# Altium schematic sheet DC075B_DEVICE_PINOUT.SchDoc: DEVICE PINOUT
size 558 x 431 mm; DrawnBy: Praveen Aroul; DocumentNumber: 6; SheetNumber: 6; SheetTotal: 13; PageSetup: Record=PageOptions|CenterHorizontal=True|CenterVertical=True|PrintScale=1.00|XCorrection=1.00|YCorrection=1.00|PrintKind=0|BorderSize=5000000|LeftOffset=0|BottomOffset=0|Orientation=2|PaperLength=1000|PaperWidth=1000|Scale=100|PaperSource=15|PrintQuality=600|MediaType=1|DitherType=10|PaperKind=Letter|PrintScaleMode=1
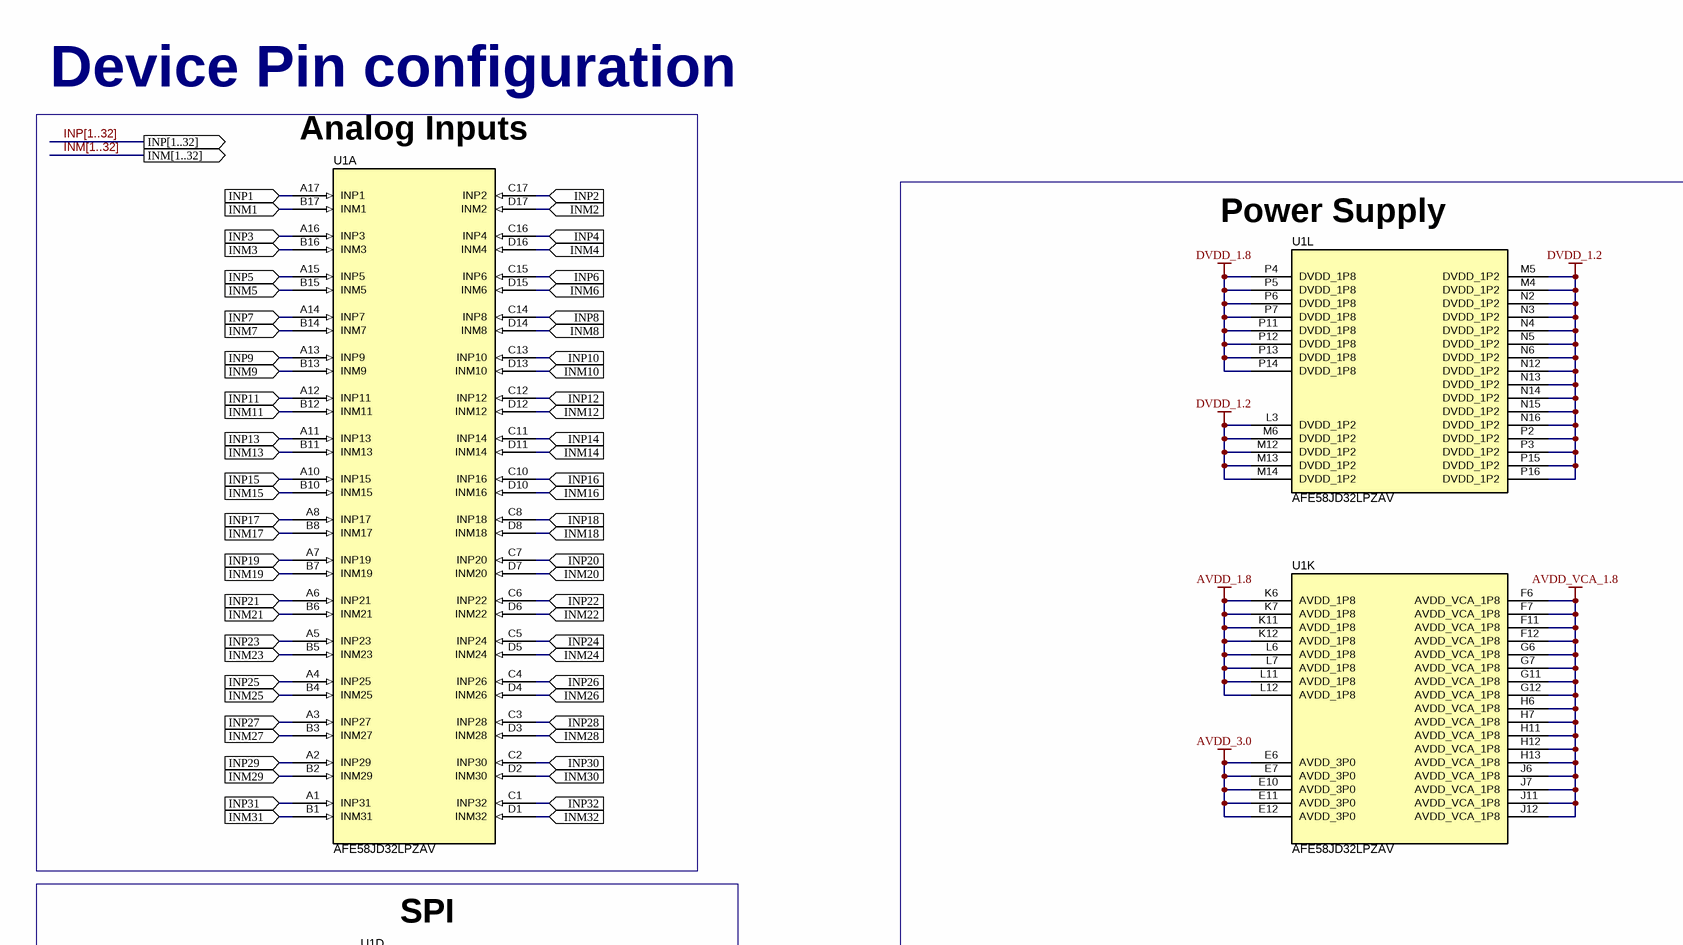
[diagram p0: DC075B_DEVICE_PINOUT.SchDoc, top left]
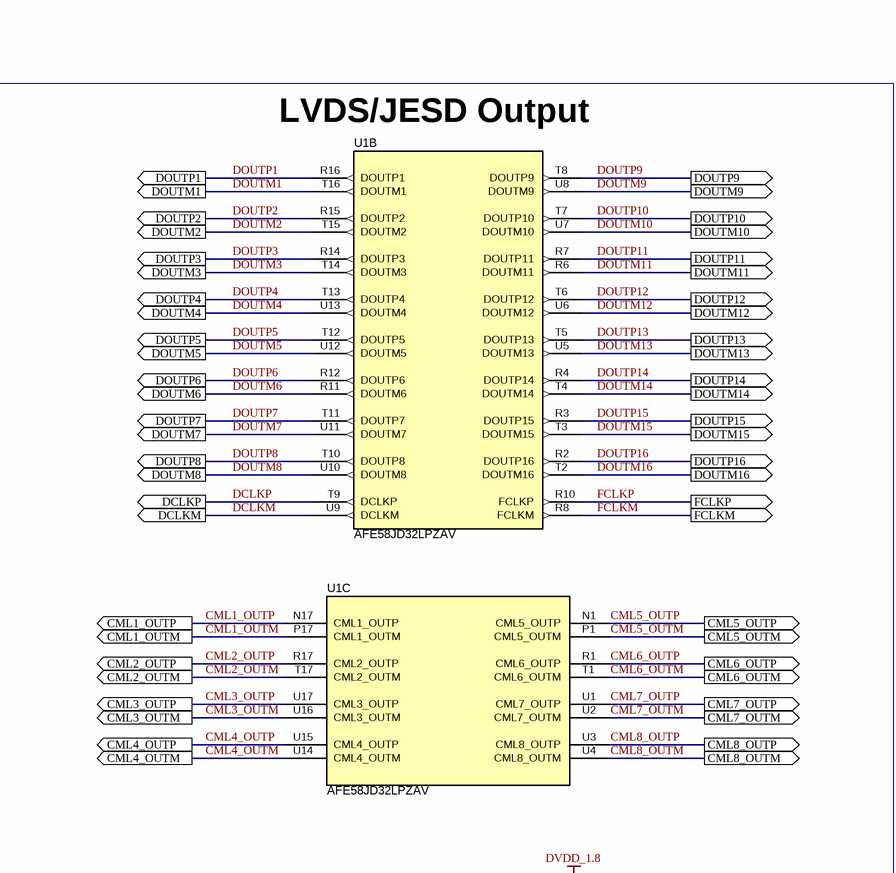
[diagram p1: DC075B_DEVICE_PINOUT.SchDoc, top right]
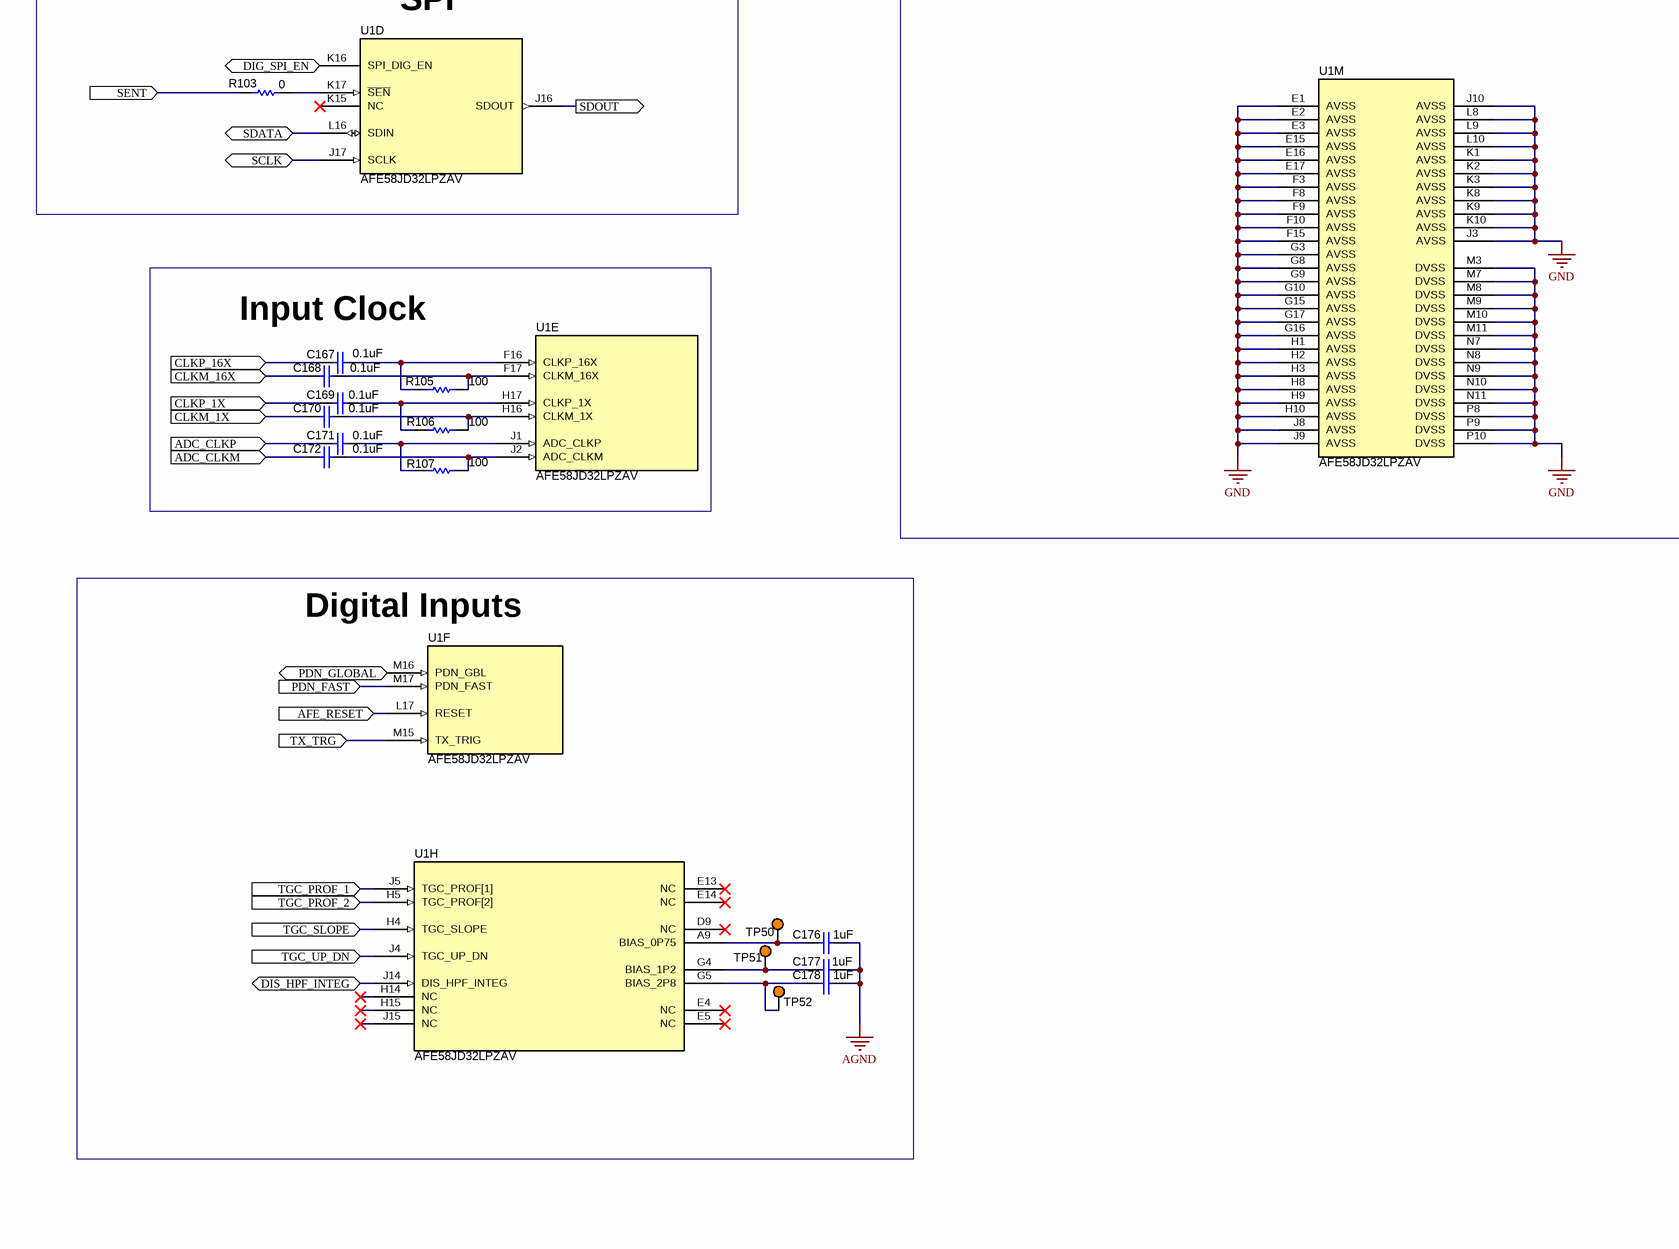
[diagram p2: DC075B_DEVICE_PINOUT.SchDoc, bottom left]
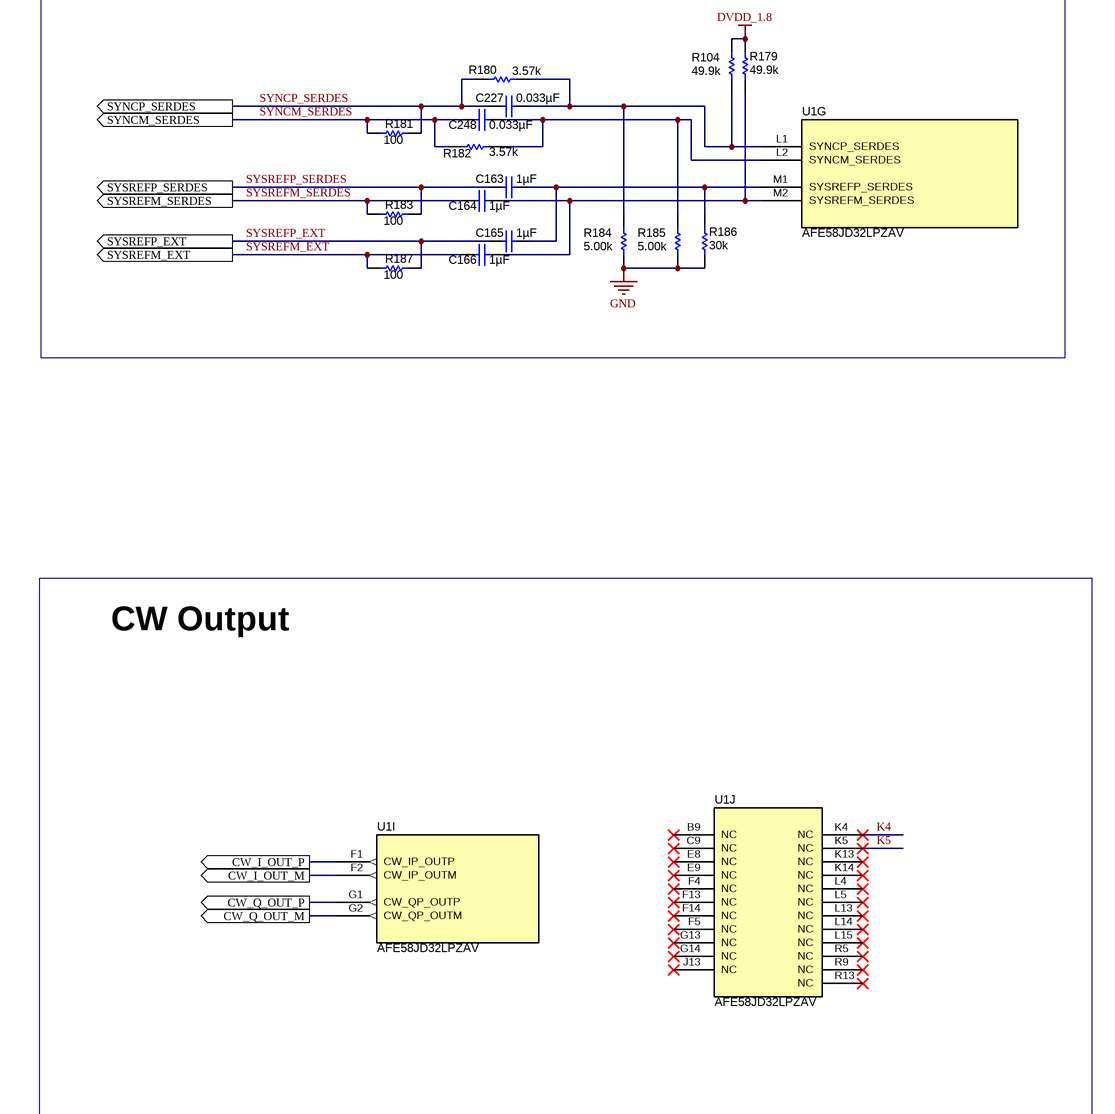
[diagram p3: DC075B_DEVICE_PINOUT.SchDoc, bottom right]

## Parts
C163  ValueDisplayed: 1µF  [0402]  (hidden comment: CL05A105JQ5NNNC)
C164  ValueDisplayed: 1µF  [0402]  (hidden comment: CL05A105JQ5NNNC)
C165  ValueDisplayed: 1µF  [0402]  (hidden comment: CL05A105JQ5NNNC)
C166  ValueDisplayed: 1µF  [0402]  (hidden comment: CL05A105JQ5NNNC)
C167  value 0.1uF  [0402]  (hidden comment: Capacitor)
C168  value 0.1uF  [0402]  (hidden comment: Capacitor)
C169  value 0.1uF  [0402]  (hidden comment: Capacitor)
C170  value 0.1uF  [0402]  (hidden comment: Capacitor)
C171  value 0.1uF  [0402]  (hidden comment: Capacitor)
C172  value 0.1uF  [0402]  (hidden comment: Capacitor)
C176  value 1uF  [0402]  (hidden comment: Capacitor)
C177  value 1uF  [0402]  (hidden comment: Capacitor)
C178  value 1uF  [0402]  (hidden comment: Capacitor)
C227  ValueDisplayed: 0.033µF  [0402]  (hidden comment: 0402YD333KAT2A)
C248  ValueDisplayed: 0.033µF  [0402]  (hidden comment: 0402YD333KAT2A)
R103  value 0  [0402]  (hidden comment: Resistor)
R104  ValueDisplayed: 49.9k  [0402]  (hidden comment: Resistor)
R105  ValueDisplayed: 100  [0402]  (hidden comment: Resistor)
R106  ValueDisplayed: 100  [0402]  (hidden comment: Resistor)
R107  ValueDisplayed: 100  [0402]  (hidden comment: Resistor)
R179  ValueDisplayed: 49.9k  [0402]  (hidden comment: Resistor)
R180  ValueDisplayed: 3.57k  [0402]  (hidden comment: Resistor)
R181  ValueDisplayed: 100  [0402]  (hidden comment: Resistor)
R182  ValueDisplayed: 3.57k  [0402]  (hidden comment: Resistor)
R183  ValueDisplayed: 100  [0402]  (hidden comment: Resistor)
R184  ValueDisplayed: 5.00k  [0402]  (hidden comment: Resistor)
R185  ValueDisplayed: 5.00k  [0402]  (hidden comment: Resistor)
R186  ValueDisplayed: 30k  [0402]  (hidden comment: Resistor)
R187  ValueDisplayed: 100  [0402]  (hidden comment: Resistor)
TP50  5003  [Keystone5003]  (value not drawn)
TP51  5003  [Keystone5003]  (value not drawn)
TP52  5003  [Keystone5003]  (value not drawn)
U1  AFE58JD32LPZAV  [ZAV0289A]  (parts A,B,C,D,E,F,G,H,I,J,K,L,M of 13)

## Blocks framed on the sheet
Device Pin configuration: U1
Power Supply: U1
LVDS/JESD Output: C163-C166 C227 C248 R104 R179-R187 U1
SPI: R103 U1
Input Clock: C167-C172 R105-R107 U1
Digital Inputs: C176-C178 TP50-TP52 U1
CW Output: U1

## Ports
ADC_CLKM (in), ADC_CLKP (in), AFE_RESET (in), CLKM_1X (in), CLKM_16X (in), CLKP_1X (in), CLKP_16X (in), CML1_OUTM (out), CML1_OUTP (out), CML2_OUTM (out), CML2_OUTP (out), CML3_OUTM (out), CML3_OUTP (out), CML4_OUTM (out), CML4_OUTP (out), CML5_OUTM (out), CML5_OUTP (out), CML6_OUTM (out), CML6_OUTP (out), CML7_OUTM (out), CML7_OUTP (out), CML8_OUTM (out), CML8_OUTP (out), CW_I_OUT_M (out), CW_I_OUT_P (out), CW_Q_OUT_M (out), CW_Q_OUT_P (out), DCLKM (out), DCLKP (out), DIG_SPI_EN (in), DIS_HPF_INTEG (bidir), DOUTM1 (out), DOUTM2 (out), DOUTM3 (out), DOUTM4 (out), DOUTM5 (out), DOUTM6 (out), DOUTM7 (out), DOUTM8 (out), DOUTM9 (out), DOUTM10 (out), DOUTM11 (out), DOUTM12 (out), DOUTM13 (out), DOUTM14 (out), DOUTM15 (out), DOUTM16 (out), DOUTP1 (out), DOUTP2 (out), DOUTP3 (out), DOUTP4 (out), DOUTP5 (out), DOUTP6 (out), DOUTP7 (out), DOUTP8 (out), DOUTP9 (out), DOUTP10 (out), DOUTP11 (out), DOUTP12 (out), DOUTP13 (out), DOUTP14 (out), DOUTP15 (out), DOUTP16 (out), FCLKM (out), FCLKP (out), INM1 (in), INM2 (in), INM3 (in), INM4 (in), INM5 (in), INM6 (in), INM7 (in), INM8 (in), INM9 (in), INM10 (in), INM11 (in), INM12 (in), INM13 (in), INM14 (in), INM15 (in), INM16 (in), INM17 (in), INM18 (in), INM19 (in), INM20 (in), INM21 (in), INM22 (in), INM23 (in), INM24 (in), INM25 (in), INM26 (in), INM27 (in), INM28 (in), INM29 (in), INM30 (in), INM31 (in), INM32 (in), INM[1..32] (out), INP1 (in), INP2 (in), INP3 (in), INP4 (in), INP5 (in), INP6 (in), INP7 (in), INP8 (in), INP9 (in), INP10 (in), INP11 (in), INP12 (in), INP13 (in), INP14 (in), INP15 (in), INP16 (in), INP17 (in), INP18 (in), INP19 (in), INP20 (in), INP21 (in), INP22 (in), INP23 (in), INP24 (in), INP25 (in), INP26 (in), INP27 (in), INP28 (in), INP29 (in), INP30 (in), INP31 (in), INP32 (in), INP[1..32] (out), PDN_FAST (in), PDN_GLOBAL (in), SCLK, SDATA, SDOUT (out), SENT (in), SYNCM_SERDES (out), SYNCP_SERDES (out), SYSREFM_EXT (out), SYSREFM_SERDES (out), SYSREFP_EXT (out), SYSREFP_SERDES (out), TGC_PROF_1 (in), TGC_PROF_2 (in), TGC_SLOPE (in), TGC_UP_DN (in), TX_TRG (in)

## Nets
AGND: C176.2 C177.2 C178.2
AVDD_1.8: U1.K6(AVDD_1P8) U1.K7(AVDD_1P8) U1.K11(AVDD_1P8) U1.K12(AVDD_1P8) U1.L6(AVDD_1P8) U1.L7(AVDD_1P8) U1.L11(AVDD_1P8) U1.L12(AVDD_1P8)
AVDD_3.0: U1.E6(AVDD_3P0) U1.E7(AVDD_3P0) U1.E10(AVDD_3P0) U1.E11(AVDD_3P0) U1.E12(AVDD_3P0)
AVDD_VCA_1.8: U1.F6(AVDD_VCA_1P8) U1.F7(AVDD_VCA_1P8) U1.F11(AVDD_VCA_1P8) U1.F12(AVDD_VCA_1P8) U1.G6(AVDD_VCA_1P8) U1.G7(AVDD_VCA_1P8) U1.G11(AVDD_VCA_1P8) U1.G12(AVDD_VCA_1P8) U1.H6(AVDD_VCA_1P8) U1.H7(AVDD_VCA_1P8) U1.H11(AVDD_VCA_1P8) U1.H12(AVDD_VCA_1P8) U1.H13(AVDD_VCA_1P8) U1.J6(AVDD_VCA_1P8) U1.J7(AVDD_VCA_1P8) U1.J11(AVDD_VCA_1P8) U1.J12(AVDD_VCA_1P8)
DVDD_1.2: U1.L3(DVDD_1P2) U1.M4(DVDD_1P2) U1.M5(DVDD_1P2) U1.M6(DVDD_1P2) U1.M12(DVDD_1P2) U1.M13(DVDD_1P2) U1.M14(DVDD_1P2) U1.N2(DVDD_1P2) U1.N3(DVDD_1P2) U1.N4(DVDD_1P2) U1.N5(DVDD_1P2) U1.N6(DVDD_1P2) U1.N12(DVDD_1P2) U1.N13(DVDD_1P2) U1.N14(DVDD_1P2) U1.N15(DVDD_1P2) U1.N16(DVDD_1P2) U1.P2(DVDD_1P2) U1.P3(DVDD_1P2) U1.P15(DVDD_1P2) U1.P16(DVDD_1P2)
DVDD_1.8: R104.2 R179.2 U1.P4(DVDD_1P8) U1.P5(DVDD_1P8) U1.P6(DVDD_1P8) U1.P7(DVDD_1P8) U1.P11(DVDD_1P8) U1.P12(DVDD_1P8) U1.P13(DVDD_1P8) U1.P14(DVDD_1P8)
GND: R184.1 R185.1 R186.1 U1.E1(AVSS) U1.E2(AVSS) U1.E3(AVSS) U1.E15(AVSS) U1.E16(AVSS) U1.E17(AVSS) U1.F3(AVSS) U1.F8(AVSS) U1.F9(AVSS) U1.F10(AVSS) U1.F15(AVSS) U1.G3(AVSS) U1.G8(AVSS) U1.G9(AVSS) U1.G10(AVSS) U1.G15(AVSS) U1.G16(AVSS) U1.G17(AVSS) U1.H1(AVSS) U1.H2(AVSS) U1.H3(AVSS) U1.H8(AVSS) U1.H9(AVSS) U1.H10(AVSS) U1.J3(AVSS) U1.J8(AVSS) U1.J9(AVSS) U1.J10(AVSS) U1.K1(AVSS) U1.K2(AVSS) U1.K3(AVSS) U1.K8(AVSS) U1.K9(AVSS) U1.K10(AVSS) U1.L8(AVSS) U1.L9(AVSS) U1.L10(AVSS) U1.M3(DVSS) U1.M7(DVSS) U1.M8(DVSS) U1.M9(DVSS) U1.M10(DVSS) U1.M11(DVSS) U1.N7(DVSS) U1.N8(DVSS) U1.N9(DVSS) U1.N10(DVSS) U1.N11(DVSS) U1.P8(DVSS) U1.P9(DVSS) U1.P10(DVSS)
ADC_CLKM: C172.2 ; port ADC_CLKM
ADC_CLKP: C171.2 ; port ADC_CLKP
AFE_RESET: U1.L17(RESET) ; port AFE_RESET
CLKM_1X: C170.2 ; port CLKM_1X
CLKM_16X: C168.2 ; port CLKM_16X
CLKP_1X: C169.2 ; port CLKP_1X
CLKP_16X: C167.2 ; port CLKP_16X
CML1_OUTM: U1.P17(CML1_OUTM) ; port CML1_OUTM
CML1_OUTP: U1.N17(CML1_OUTP) ; port CML1_OUTP
CML2_OUTM: U1.T17(CML2_OUTM) ; port CML2_OUTM
CML2_OUTP: U1.R17(CML2_OUTP) ; port CML2_OUTP
CML3_OUTM: U1.U16(CML3_OUTM) ; port CML3_OUTM
CML3_OUTP: U1.U17(CML3_OUTP) ; port CML3_OUTP
CML4_OUTM: U1.U14(CML4_OUTM) ; port CML4_OUTM
CML4_OUTP: U1.U15(CML4_OUTP) ; port CML4_OUTP
CML5_OUTM: U1.P1(CML5_OUTM) ; port CML5_OUTM
CML5_OUTP: U1.N1(CML5_OUTP) ; port CML5_OUTP
CML6_OUTM: U1.T1(CML6_OUTM) ; port CML6_OUTM
CML6_OUTP: U1.R1(CML6_OUTP) ; port CML6_OUTP
CML7_OUTM: U1.U2(CML7_OUTM) ; port CML7_OUTM
CML7_OUTP: U1.U1(CML7_OUTP) ; port CML7_OUTP
CML8_OUTM: U1.U4(CML8_OUTM) ; port CML8_OUTM
CML8_OUTP: U1.U3(CML8_OUTP) ; port CML8_OUTP
CW_I_OUT_M: U1.F2(CW_IP_OUTM) ; port CW_I_OUT_M
CW_I_OUT_P: U1.F1(CW_IP_OUTP) ; port CW_I_OUT_P
CW_Q_OUT_M: U1.G2(CW_QP_OUTM) ; port CW_Q_OUT_M
CW_Q_OUT_P: U1.G1(CW_QP_OUTP) ; port CW_Q_OUT_P
DCLKM: U1.U9(DCLKM) ; port DCLKM
DCLKP: U1.T9(DCLKP) ; port DCLKP
DIG_SPI_EN: U1.K16(SPI_DIG_EN) ; port DIG_SPI_EN
DIS_HPF_INTEG: U1.J14(DIS_HPF_INTEG) ; port DIS_HPF_INTEG
DOUTM1: U1.T16(DOUTM1) ; port DOUTM1
DOUTM2: U1.T15(DOUTM2) ; port DOUTM2
DOUTM3: U1.T14(DOUTM3) ; port DOUTM3
DOUTM4: U1.U13(DOUTM4) ; port DOUTM4
DOUTM5: U1.U12(DOUTM5) ; port DOUTM5
DOUTM6: U1.R11(DOUTM6) ; port DOUTM6
DOUTM7: U1.U11(DOUTM7) ; port DOUTM7
DOUTM8: U1.U10(DOUTM8) ; port DOUTM8
DOUTM9: U1.U8(DOUTM9) ; port DOUTM9
DOUTM10: U1.U7(DOUTM10) ; port DOUTM10
DOUTM11: U1.R6(DOUTM11) ; port DOUTM11
DOUTM12: U1.U6(DOUTM12) ; port DOUTM12
DOUTM13: U1.U5(DOUTM13) ; port DOUTM13
DOUTM14: U1.T4(DOUTM14) ; port DOUTM14
DOUTM15: U1.T3(DOUTM15) ; port DOUTM15
DOUTM16: U1.T2(DOUTM16) ; port DOUTM16
DOUTP1: U1.R16(DOUTP1) ; port DOUTP1
DOUTP2: U1.R15(DOUTP2) ; port DOUTP2
DOUTP3: U1.R14(DOUTP3) ; port DOUTP3
DOUTP4: U1.T13(DOUTP4) ; port DOUTP4
DOUTP5: U1.T12(DOUTP5) ; port DOUTP5
DOUTP6: U1.R12(DOUTP6) ; port DOUTP6
DOUTP7: U1.T11(DOUTP7) ; port DOUTP7
DOUTP8: U1.T10(DOUTP8) ; port DOUTP8
DOUTP9: U1.T8(DOUTP9) ; port DOUTP9
DOUTP10: U1.T7(DOUTP10) ; port DOUTP10
DOUTP11: U1.R7(DOUTP11) ; port DOUTP11
DOUTP12: U1.T6(DOUTP12) ; port DOUTP12
DOUTP13: U1.T5(DOUTP13) ; port DOUTP13
DOUTP14: U1.R4(DOUTP14) ; port DOUTP14
DOUTP15: U1.R3(DOUTP15) ; port DOUTP15
DOUTP16: U1.R2(DOUTP16) ; port DOUTP16
FCLKM: U1.R8(FCLKM) ; port FCLKM
FCLKP: U1.R10(FCLKP) ; port FCLKP
INM1: U1.B17(INM1) ; port INM1
INM2: U1.D17(INM2) ; port INM2
INM3: U1.B16(INM3) ; port INM3
INM4: U1.D16(INM4) ; port INM4
INM5: U1.B15(INM5) ; port INM5
INM6: U1.D15(INM6) ; port INM6
INM7: U1.B14(INM7) ; port INM7
INM8: U1.D14(INM8) ; port INM8
INM9: U1.B13(INM9) ; port INM9
INM10: U1.D13(INM10) ; port INM10
INM11: U1.B12(INM11) ; port INM11
INM12: U1.D12(INM12) ; port INM12
INM13: U1.B11(INM13) ; port INM13
INM14: U1.D11(INM14) ; port INM14
INM15: U1.B10(INM15) ; port INM15
INM16: U1.D10(INM16) ; port INM16
INM17: U1.B8(INM17) ; port INM17
INM18: U1.D8(INM18) ; port INM18
INM19: U1.B7(INM19) ; port INM19
INM20: U1.D7(INM20) ; port INM20
INM21: U1.B6(INM21) ; port INM21
INM22: U1.D6(INM22) ; port INM22
INM23: U1.B5(INM23) ; port INM23
INM24: U1.D5(INM24) ; port INM24
INM25: U1.B4(INM25) ; port INM25
INM26: U1.D4(INM26) ; port INM26
INM27: U1.B3(INM27) ; port INM27
INM28: U1.D3(INM28) ; port INM28
INM29: U1.B2(INM29) ; port INM29
INM30: U1.D2(INM30) ; port INM30
INM31: U1.B1(INM31) ; port INM31
INM32: U1.D1(INM32) ; port INM32
INP1: U1.A17(INP1) ; port INP1
INP2: U1.C17(INP2) ; port INP2
INP3: U1.A16(INP3) ; port INP3
INP4: U1.C16(INP4) ; port INP4
INP5: U1.A15(INP5) ; port INP5
INP6: U1.C15(INP6) ; port INP6
INP7: U1.A14(INP7) ; port INP7
INP8: U1.C14(INP8) ; port INP8
INP9: U1.A13(INP9) ; port INP9
INP10: U1.C13(INP10) ; port INP10
INP11: U1.A12(INP11) ; port INP11
INP12: U1.C12(INP12) ; port INP12
INP13: U1.A11(INP13) ; port INP13
INP14: U1.C11(INP14) ; port INP14
INP15: U1.A10(INP15) ; port INP15
INP16: U1.C10(INP16) ; port INP16
INP17: U1.A8(INP17) ; port INP17
INP18: U1.C8(INP18) ; port INP18
INP19: U1.A7(INP19) ; port INP19
INP20: U1.C7(INP20) ; port INP20
INP21: U1.A6(INP21) ; port INP21
INP22: U1.C6(INP22) ; port INP22
INP23: U1.A5(INP23) ; port INP23
INP24: U1.C5(INP24) ; port INP24
INP25: U1.A4(INP25) ; port INP25
INP26: U1.C4(INP26) ; port INP26
INP27: U1.A3(INP27) ; port INP27
INP28: U1.C3(INP28) ; port INP28
INP29: U1.A2(INP29) ; port INP29
INP30: U1.C2(INP30) ; port INP30
INP31: U1.A1(INP31) ; port INP31
INP32: U1.C1(INP32) ; port INP32
K4: U1.K4(NC)
K5: U1.K5(NC)
PDN_FAST: U1.M17(PDN_FAST) ; port PDN_FAST
PDN_GLOBAL: U1.M16(PDN_GBL) ; port PDN_GLOBAL
SCLK: U1.J17(SCLK) ; port SCLK
SDATA: U1.L16(SDIN) ; port SDATA
SDOUT: U1.J16(SDOUT) ; port SDOUT
SENT: R103.1 ; port SENT
SYNCM_SERDES: C248.2 R181.1 R182.1 ; port SYNCM_SERDES
SYNCP_SERDES: C227.2 R180.1 R181.2 ; port SYNCP_SERDES
SYSREFM_EXT: C166.2 R187.1 ; port SYSREFM_EXT
SYSREFM_SERDES: C164.2 R183.1 ; port SYSREFM_SERDES
SYSREFP_EXT: C165.2 R187.2 ; port SYSREFP_EXT
SYSREFP_SERDES: C163.2 R183.2 ; port SYSREFP_SERDES
TGC_PROF_1: U1.J5(TGC_PROF[1]) ; port TGC_PROF_1
TGC_PROF_2: U1.H5(TGC_PROF[2]) ; port TGC_PROF_2
TGC_SLOPE: U1.H4(TGC_SLOPE) ; port TGC_SLOPE
TGC_UP_DN: U1.J4(TGC_UP_DN) ; port TGC_UP_DN
TX_TRG: U1.M15(TX_TRIG) ; port TX_TRG
NetC163_1: C163.1 C165.1 R186.2 U1.M1(SYSREFP_SERDES)
NetC164_1: C164.1 C166.1 R179.1 U1.M2(SYSREFM_SERDES)
NetC167_1: C167.1 R105.1 U1.F16(CLKP_16X)
NetC168_1: C168.1 R105.2 U1.F17(CLKM_16X)
NetC169_1: C169.1 R106.1 U1.H17(CLKP_1X)
NetC170_1: C170.1 R106.2 U1.H16(CLKM_1X)
NetC171_1: C171.1 R107.1 U1.J1(ADC_CLKP)
NetC172_1: C172.1 R107.2 U1.J2(ADC_CLKM)
NetC176_1: C176.1 TP50.1 U1.A9(BIAS_0P75)
NetC177_1: C177.1 TP51.1 U1.G4(BIAS_1P2)
NetC178_1: C178.1 TP52.1 U1.G5(BIAS_2P8)
NetC227_1: C227.1 R104.1 R180.2 R184.2 U1.L1(SYNCP_SERDES)
NetC248_1: C248.1 R182.2 R185.2 U1.L2(SYNCM_SERDES)
NetR103_2: R103.2 U1.K17(~{SEN})

Not connected (* = marked no-connect by the designer): U1 B9(NC)* C9(NC)* D9(NC)* E4(NC)* E5(NC)* E8(NC)* E9(NC)* E13(NC)* E14(NC)* F4(NC)* F5(NC)* F13(NC)* F14(NC)* G13(NC)* G14(NC)* H14(NC)* H15(NC)* J13(NC)* J15(NC)* K13(NC)* K14(NC)* K15(NC)* L4(NC)* L5(NC)* L13(NC)* L14(NC)* L15(NC)* R5(NC)* R9(NC)* R13(NC)*

## Buses and harness runs
bus INM[1..32] = port INM[1..32]
bus INP[1..32] = port INP[1..32]

## Notes on the sheet
- (near U1) Analog Inputs
- Drawn By:
- SVN Rev:
- Number:
- TID #:
- Orderable:
- Rev:
- Sheet Title:
- File:
- Project Title:
- Designed for:
- Assembly Variant:
- Mod. Date:
- Sheet:
- Size:
- of
- C
- http://www.ti.com
- Texas Instruments and/or its licensors do not warrant the accuracy or completeness of this specification or any information contained therein. Texas Instruments and/or its licensors do not warrant that this design will meet the specifications, will be suitable for your application or fit for any particular purpose, or will operate in an implementation. Texas Instruments and/or its licensors do not warrant that the design is production worthy. You should completely validate and test your design implementation to confirm the system functionality for your application.
- Engineer:
- Contact:
- © Texas Instruments

## Library data of the parts
C163-C166 = CMP-0085575-1: CAP, CERM, 1 µF, 6.3 V,+/- 5%, X5R, 0402; Manufacturer: Samsung Electro-Mechanics; Polarized: N; Value: 1uF; U/M: EA; VDC_V: 6.3V; TaMin_C: -55°C; TaMax_C: 85°C; SizeArea_mm2: 0.5; SizeAreaWB_mm2: 3; SizeX_mm: 1; SizeZ_mm: 0.6; AEC Category: Q200; CompType: Capacitor; PartNumber: CL05A105JQ5NNNC; PackageReference: 0402; RoHS: Y; Cap_F: 1µF; Tolerance_%: 5%; Value2: 6.3V; MountType: SMT; Technology: Ceramic; TempCo: X5R; Cap_Case: 0402; ComponentLink1Description: Datasheet link; ComponentLink1URL: http://www.samsungsem.com/kr/support/product-search/mlcc/__icsFiles/afieldfile/2018/06/19/CL05A105JQ5NNNC.pdf; SizeY_mm: 0.5; AEC Qualified: N; AEC Grade: N/A
C167-C172 = CMP-0006641-2: CAP, CERM, 0.1 uF, 16 V, +/- 10%, X7R, 0402; PartNumber: GRM155R71C104KA88D; Manufacturer: MuRata; Polarized: N; U/M: EA; Cap_F: 100nF; Value1: Unknown; VDC_V: 16V; TaMin_C: -55°C; TaMax_C: 125°C; AEC Category: Q200; SizeArea_mm2: 0.5; SizeAreaWB_mm2: 3; SizeX_mm: 1; SizeZ_mm: 0.6; CompType: Capacitor; ValueDisplayed: 0.1uF; PackageReference: 0402; RoHS: Y; Tolerance_%: 10%; Value2: 16V; MountType: SMT; Technology: Ceramic; TempCo: X7R; Cap_Case: 0402; Published: 2008-06-19; Publisher: Texas Instruments; LatestRevisionDate: 2017-03-09; ComponentLink1Description: Datasheet link; ComponentLink1URL: http://search.murata.co.jp/Ceramy/PnsearchViewAction.do?HnOFG=ON&HnNFG=ON&SEL_CNT=50&sLang=en&sKey=GRM155R71C104KA88D&x=9&y=9&search=startwith; Supplier 1: Digi-Key; Supplier Part Number 1: 490-3261-1-ND; Supplier 2: Newark; Supplier Part Number 2: 38K1647; Supplier 3: Mouser; Supplier Part Number 3: 81-GRM155R71C104KA88; AEC Qualified: ?; SizeY_mm: 0.5
C176-C178 = CMP-0006372-2: CAP, CERM, 1 uF, 6.3 V, +/- 20%, X5R, 0402; PartNumber: GRM152R60J105ME15D; Manufacturer: MuRata; Polarized: N; U/M: EA; Cap_F: 1µF; Value1: Unknown; VDC_V: 6.3V; TaMin_C: -55°C; TaMax_C: 85°C; AEC Category: Q200; SizeArea_mm2: 0.5; SizeAreaWB_mm2: 3; SizeX_mm: 1; SizeZ_mm: 0.6; CompType: Capacitor; PackageReference: 0402; RoHS: Y; MountType: SMT; ComponentLink1Description: Datasheet link; ComponentLink1URL: http://psearch.murata.com/capacitor/product/GRM152R60J105ME15%23.pdf; ValueDisplayed: 1uF; Tolerance_%: 20%; Value2: 6.3V; Technology: Ceramic; TempCo: X5R; Cap_Case: 0402; Published: 2008-06-19; Publisher: Texas Instruments; LatestRevisionDate: 2017-03-09; Supplier 1: Digi-Key; Supplier Part Number 1: 490-10006-1-ND; Supplier 2: Mouser; Supplier Part Number 2: 81-GRM152R60J105ME5D; AEC Qualified: ?; SizeY_mm: 0.5
C227 C248 = CMP-0085569-1: CAP, CERM, 0.033 µF, 16 V,+/- 10%, X5R, 0402; Manufacturer: AVX; Polarized: N; Value: 0.033uF; U/M: EA; Cap_F: 33nF; VDC_V: 16V; TaMin_C: -55°C; TaMax_C: 85°C; SizeArea_mm2: 0.5; SizeAreaWB_mm2: 3; SizeX_mm: 1; SizeZ_mm: 0.6; AEC Category: Q200; CompType: Capacitor; PartNumber: 0402YD333KAT2A; PackageReference: 0402; RoHS: Y; Tolerance_%: 10%; Value2: 16V; MountType: SMT; Technology: Ceramic; TempCo: X5R; Cap_Case: 0402; ComponentLink1Description: Datasheet link; ComponentLink1URL: http://datasheets.avx.com/cx5r.pdf; SizeY_mm: 0.5; AEC Qualified: N; AEC Grade: N/A
R103 = CMP-0026822-3: RES, 0, 5%, 0.063 W, AEC-Q200 Grade 0, 0402; Manufacturer: Vishay-Dale; PartNumber: CRCW04020000Z0ED; Value_Code: 0000; Power_W: 63mW; Value2: 0.063W; VDC_V: 50V; TempCo: 200 ppm/C; EIA_Code: E24; AEC Category: Q200; AEC Qualified: Y; SizeArea_mm2: 0.5; SizeX_mm: 1; SizeZ_mm: 0.6; ComponentLink1Description: Datasheet link; ComponentLink1URL: http://www.vishay.com/docs/20035/dcrcwe3.pdf; CompType: Resistor; MountType: SMT; PackageReference: 0402; RoHS: E; ValueDisplayed: 0; Res_ohm: 0; Tolerance_%: 5%; Value1: 5%; Technology: Thick Film; Supplier 1: Digi-Key; Supplier Part Number 1: 541-0.0JCT-ND; Supplier 2: Newark; Supplier Part Number 2: 52K6543; Supplier 3: Mouser; Supplier Part Number 3: 71-CRCW0402-0-E3; AEC Grade: 0; SizeY_mm: 0.5
R104 R179 = CMP-0026403-2: RES, 49.9 k, 1%, 0.063 W, AEC-Q200 Grade 0, 0402; PartNumber: CRCW040249K9FKED; Manufacturer: Vishay-Dale; Value: 49.9k; Value_Code: 49k9; Power_W: 63mW; Value2: 0.063W; VDC_V: 50V; TempCo: 100 ppm/C; SizeArea_mm2: 0.5; SizeX_mm: 1; SizeZ_mm: 0.6; EIA_Code: E96; AEC Category: Q200; AEC Qualified: Y; AEC Grade: 0; CompType: Resistor; PackageReference: 0402; RoHS: E; Res_ohm: 49.9k; Tolerance_%: 1%; Value1: 1%; MountType: SMT; Technology: Thick Film; SizeY_mm: 0.5; ComponentLink1Description: Datasheet link; ComponentLink1URL: http://www.vishay.com/docs/20035/dcrcwe3.pdf; Supplier 1: Digi-Key; Supplier Part Number 1: 541-49.9KLCT-ND; Supplier 2: Newark; Supplier Part Number 2: 52K7113; Supplier 3: Mouser; Supplier Part Number 3: 71-CRCW0402-49.9K-E3
R105-R107 R181 R183 R187 = CMP-0026656-1: RES, 100, 1%, 0.1 W, 0402; Manufacturer: Panasonic; PartNumber: ERJ-2RKF1000X; Value: 100; Value_Code: 100R; Power_W: 100mW; Value2: 0.1W; VDC_V: 50V; TempCo: 100 ppm/C; EIA_Code: E96; U/M: EA; AEC Category: Q200; SizeArea_mm2: 0.5; SizeX_mm: 1; SizeZ_mm: 0.6; ComponentLink1Description: Datasheet link; ComponentLink1URL: http://industrial.panasonic.com/www-data/pdf/AOA0000/AOA0000CE2.pdf; CompType: Resistor; MountType: SMT; PackageReference: 0402; RoHS: Y; Res_ohm: 100; Tolerance_%: 1%; Value1: 1%; Technology: Thick Film; Published: 2008-06-26; Publisher: Texas Instruments; LatestRevisionDate: 2017-03-09; Supplier 1: Digi-Key; Supplier Part Number 1: P100LCT-ND; Supplier 2: Newark; Supplier Part Number 2: 64R5246; Supplier 3: Mouser; Supplier Part Number 3: 667-ERJ-2RKF1000X; AEC Qualified: ?; SizeY_mm: 0.5
R180 R182 = CMP-0026336-2: RES, 3.57 k, 1%, 0.063 W, AEC-Q200 Grade 0, 0402; PartNumber: CRCW04023K57FKED; Manufacturer: Vishay-Dale; Value: 3.57k; Value_Code: 3k57; Power_W: 63mW; Value2: 0.063W; VDC_V: 50V; TempCo: 100 ppm/C; SizeArea_mm2: 0.5; SizeX_mm: 1; SizeZ_mm: 0.6; EIA_Code: E96; AEC Category: Q200; AEC Qualified: Y; AEC Grade: 0; CompType: Resistor; PackageReference: 0402; RoHS: E; Res_ohm: 3.57k; Tolerance_%: 1%; Value1: 1%; MountType: SMT; Technology: Thick Film; SizeY_mm: 0.5; ComponentLink1Description: Datasheet link; ComponentLink1URL: http://www.vishay.com/docs/20035/dcrcwe3.pdf; Supplier 1: Digi-Key; Supplier Part Number 1: 541-3.57KLCT-ND; Supplier 2: Newark; Supplier Part Number 2: 52K6946; Supplier 3: Mouser; Supplier Part Number 3: 71-CRCW0402-3.57K-E3
R184 R185 = CMP-0026813-1: RES, 5.00 k, 0.1%, 0.05 W, 0402; PartNumber: PNM0402E5001BST1; Manufacturer: Vishay-Dale; Value: 5.00k; Res_ohm: 5k; Value_Code: 5k00; Power_W: 50mW; Value2: 0.05W; VDC_V: 75V; TempCo: 25 ppm/C; SizeArea_mm2: 0.5; SizeX_mm: 1; SizeZ_mm: 0.6; U/M: EA; AEC Category: Q200; AEC Qualified: N; CompType: Resistor; PackageReference: 0402; RoHS: Y; Tolerance_%: 0.1%; Value1: 0.1%; MountType: SMT; Technology: Thin Film; SizeY_mm: 0.5; Published: 2008-06-26; Publisher: Texas Instruments; LatestRevisionDate: 2017-03-09; ComponentLink1Description: Datasheet link; ComponentLink1URL: http://www.vishay.com/docs/60057/pnm.pdf; Supplier 1: Digi-Key; Supplier Part Number 1: 541-1901-1-ND; Supplier 2: Mouser; Supplier Part Number 2: 71-PNM0402E5001BST1; AEC Grade: N/A
R186 = CMP-0026903-3: RES, 30 k, 5%, 0.063 W, AEC-Q200 Grade 0, 0402; PartNumber: CRCW040230K0JNED; Manufacturer: Vishay-Dale; Value: 30k; Value_Code: 30k0; Power_W: 63mW; Value2: 0.063W; VDC_V: 50V; TempCo: 200 ppm/C; SizeArea_mm2: 0.5; SizeX_mm: 1; SizeZ_mm: 0.6; EIA_Code: E24; AEC Category: Q200; AEC Qualified: Y; AEC Grade: 0; CompType: Resistor; PackageReference: 0402; RoHS: E; Res_ohm: 30k; Tolerance_%: 5%; Value1: 5%; MountType: SMT; Technology: Thick Film; SizeY_mm: 0.5; ComponentLink1Description: Datasheet link; ComponentLink1URL: http://www.vishay.com/docs/20035/dcrcwe3.pdf; Supplier 1: Digi-Key; Supplier Part Number 1: 541-30KJCT-ND; Supplier 2: Newark; Supplier Part Number 2: 59M6726; Supplier 3: Mouser; Supplier Part Number 3: 71-CRCW0402J-30K-E3
TP50-TP52 = CMP-0055140-1: Test Point, Miniature, Orange, TH; Manufacturer: Keystone; CNHeader: FALSE; ContactFinish: Silver; CT: TRUE; Green_Lifecycle: Active; Green_REACh: Passed; PartNumber: 5003; PackageReference: Orange Miniature Testpoint; CompType: Test Point; RoHS: Y; MountType: TH; ComponentLink1Description: Datasheet URL; ComponentLink1URL: http://www.keyelco.com/userAssets/file/M60-2p60.pdf; Publisher: Texas Instruments; LatestRevisionDate: 26/05/2017; Supplier 1: Digi-Key; Supplier Part Number 1: 36-5003-ND; Supplier 2: Mouser; Supplier Part Number 2: 534-5003; Color: Orange; Green_EU RoHS-2: Incomplete; Green_EU RoHS: Passed
U1 = CMP-0084577-3: 32-Channel Ultrasound AFE with 28-mW/Channel Power, 4 nV/√Hz, 12-Bit, 40-MSPS or 10-Bit, 50-MSPS output and Passive CW Mixer, ZAV0289A (NFBGA-289); Manufacturer: Texas Instruments; SizeArea_mm2: 225; SizeAreaWB_mm2: 289; SizeX_mm: 15; SizeZ_mm: 1.4; CompType: IC; AEC Category: Q200; AEC Qualified: N; PartNumber: AFE58JD32LPZAV; PackageReference: ZAV0289A; PackageDescription: NFBGA-289; MountType: SMT; SizeY_mm: 15; ComponentLink1Description: Datasheet Link; ComponentLink1URL: http://www.ti.com/lit/ds/symlink/afe58jd32lp.pdf; RoHS: Y; Alternate Manufacturer: Texas Instruments; ComponentLink2Description: Product Folder; ComponentLink2URL: http://www.ti.com/product/afe58jd32lp; ComponentLink3Description: Online Datasheet; ComponentLink3URL: http://www.ti.com/product/afe58jd32lp/datasheet